# Altium schematic sheet IsolationBarriers.SchDoc
size A4; SheetNumber: 8; SheetTotal: 9
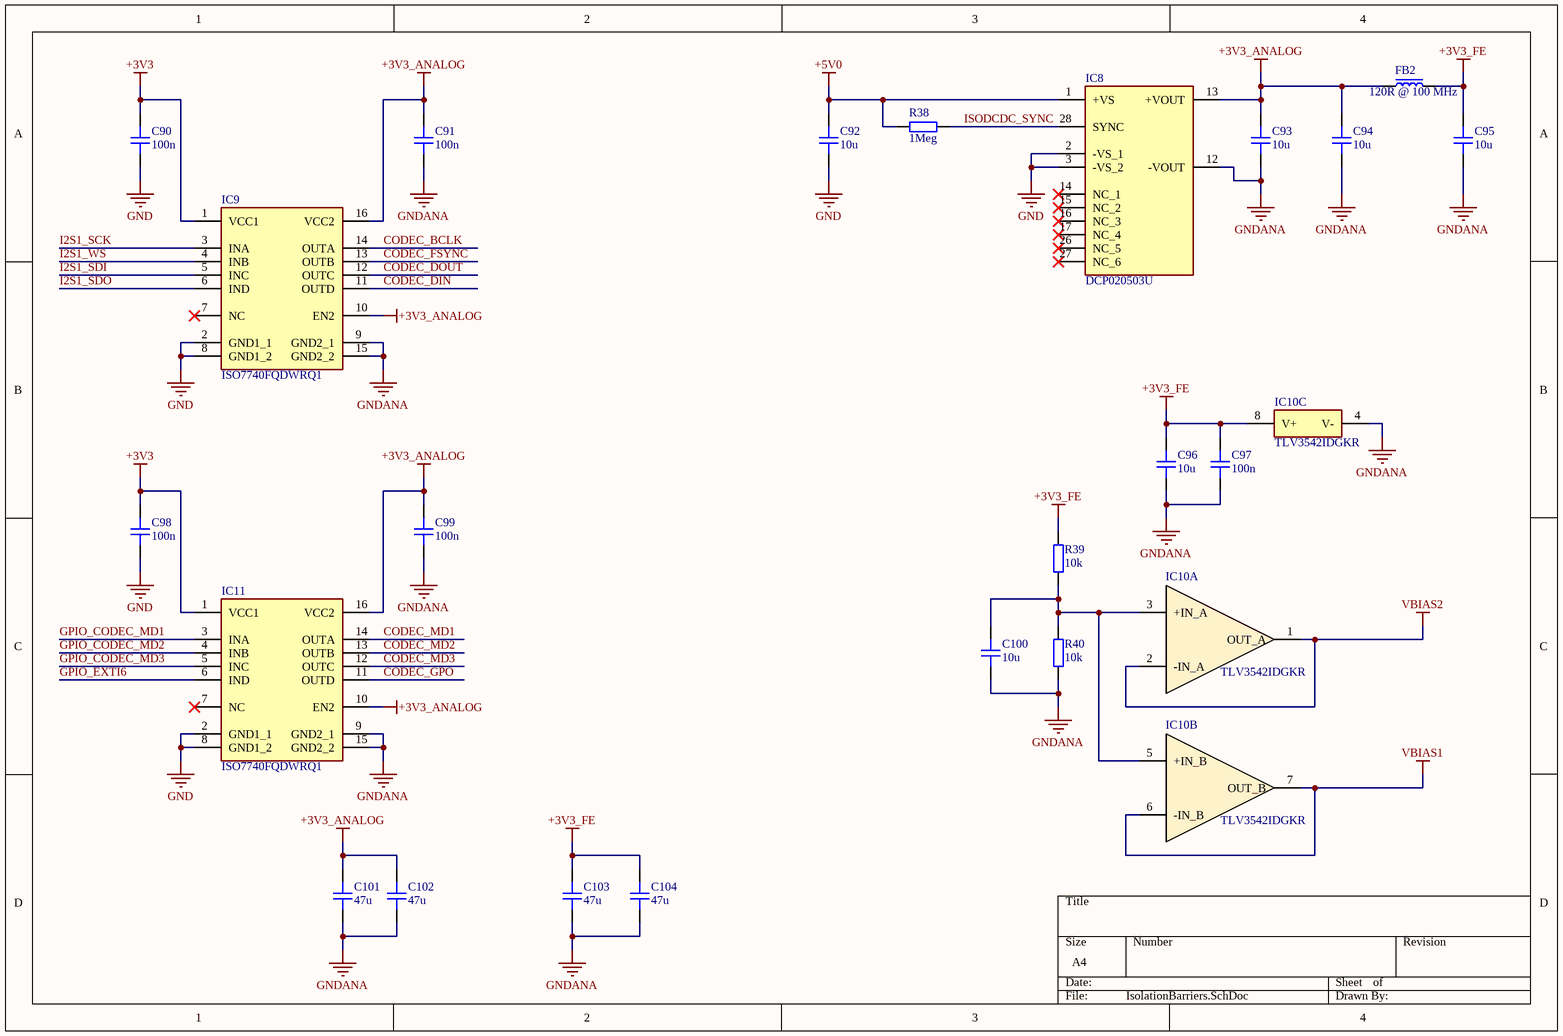
[diagram p0: IsolationBarriers.SchDoc]

## Parts
C90  100n  [CAP_0402]
C91  100n  [CAP_0402]
C92  10u  [CAP_0603]
C93  10u  [CAP_0603]
C94  10u  [CAP_0603]
C95  10u  [CAP_0603]
C96  10u  [CAP_0603]
C97  100n  [CAP_0402]
C98  100n  [CAP_0402]
C99  100n  [CAP_0402]
C100  10u  [CAP_0603]
C101  47u  [CAP_1210]
C102  47u  [CAP_1210]
C103  47u  [CAP_1210]
C104  47u  [CAP_1210]
FB2  120R @ 100 MHz  [FB_0603]
IC8  DCP020503U  [DVB0012A]
IC9  ISO7740FQDWRQ1  [SOIC127P1030X265-16N]
IC10  TLV3542IDGKR  [SOP65P490X110-8N]  (parts A,B,C of 3)
IC11  ISO7740FQDWRQ1  [SOIC127P1030X265-16N]
R38  1Meg  [RES_0402]
R39  10k  [RES_0603]
R40  10k  [RES_0603]

## Nets
+3V3: C90.2 C98.2 IC9.1(VCC1) IC11.1(VCC1)
+3V3_ANALOG: C91.2 C93.2 C94.2 C99.2 C101.2 C102.2 FB2.1 IC8.13(+VOUT) IC9.10(EN2) IC9.16(VCC2) IC11.10(EN2) IC11.16(VCC2)
+3V3_FE: C95.2 C96.2 C97.2 C103.2 C104.2 FB2.2 IC10.8(V+) R39.2
+5V0: C92.2 IC8.1(+VS) R38.1
GND: C90.1 C92.1 C98.1 IC8.2(-VS_1) IC8.3(-VS_2) IC9.2(GND1_1) IC9.8(GND1_2) IC11.2(GND1_1) IC11.8(GND1_2)
GNDANA: C91.1 C93.1 C94.1 C95.1 C96.1 C97.1 C99.1 C100.1 C101.1 C102.1 C103.1 C104.1 IC8.12(-VOUT) IC9.9(GND2_1) IC9.15(GND2_2) IC10.4(V-) IC11.9(GND2_1) IC11.15(GND2_2) R40.1
VBIAS1: IC10.6(-IN_B) IC10.7(OUT_B)
VBIAS2: IC10.1(OUT_A) IC10.2(-IN_A)
CODEC_BCLK: IC9.14(OUTA)
CODEC_DIN: IC9.11(OUTD)
CODEC_DOUT: IC9.12(OUTC)
CODEC_FSYNC: IC9.13(OUTB)
CODEC_GPO: IC11.11(OUTD)
CODEC_MD1: IC11.14(OUTA)
CODEC_MD2: IC11.13(OUTB)
CODEC_MD3: IC11.12(OUTC)
GPIO_CODEC_MD1: IC11.3(INA)
GPIO_CODEC_MD2: IC11.4(INB)
GPIO_CODEC_MD3: IC11.5(INC)
GPIO_EXTI6: IC11.6(IND)
I2S1_SCK: IC9.3(INA)
I2S1_SDI: IC9.5(INC)
I2S1_SDO: IC9.6(IND)
I2S1_WS: IC9.4(INB)
ISODCDC_SYNC: IC8.28(SYNC) R38.2
NetC100_2: C100.2 IC10.3(+IN_A) IC10.5(+IN_B) R39.1 R40.2

Not connected (* = marked no-connect by the designer): IC8 14(NC_1)* 15(NC_2)* 16(NC_3)* 17(NC_4)* 26(NC_5)* 27(NC_6)*; IC9 7(NC)*; IC11 7(NC)*

## Library data of the parts
C90 C91 C97-C99 = CAP_0402: Capacitor SMD 0402; Manufacturer: *; Manufacturer Part Number: *; Distributor Link: *; LCSC: *; Rating: *; Dielectric: *
C92-C96 C100 = CAP_0603: Capacitor SMD 0603; Manufacturer: *; Manufacturer Part Number: *; Distributor Link: *; LCSC: *; Rating: *; Dielectric: *
C101-C104 = CAP_1210: Capacitor SMD 1210; Manufacturer: *; Manufacturer Part Number: *; Distributor Link: *; LCSC: *; Rating: *; Dielectric: *
FB2 = FB_0603: Ferrite Bead SMD 0603; Manufacturer: *; Manufacturer Part Number: *; Distributor Link: *; LCSC: *
IC8 = DCP020503U: TI Isolated DC DC Converter; Manufacturer_Name: Texas Instruments; Datasheet Link: http://www.ti.com/lit/gpn/dcp020503; Manufacturer_Part_Number: DCP020503U; Mouser Part Number: 595-DCP020503U; Mouser Price/Stock: https://www.mouser.com/Search/Refine.aspx?Keyword=595-DCP020503U; Arrow Part Number: DCP020503U; Arrow Price/Stock: https://www.arrow.com/en/products/dcp020503u/texas-instruments
IC9 IC11 = ISO7740FQDWRQ1: Integrated Circuit; Manufacturer_Name: Texas Instruments; Datasheet Link: https://www.ti.com/lit/gpn/iso7740-q1; Height: 2.65mm; Manufacturer_Part_Number: ISO7740FQDWRQ1; Mouser Part Number: 595-ISO7740FQDWRQ1; Mouser Price/Stock: https://www.mouser.co.uk/ProductDetail/Texas-Instruments/ISO7740FQDWRQ1?qs=34RfhUjJmKfM2MieHZI64w%3D%3D; Arrow Part Number: ISO7740FQDWRQ1; Arrow Price/Stock: https://www.arrow.com/en/products/iso7740fqdwrq1/texas-instruments?utm_currency=USD&region=nac
IC10 = TLV3542IDGKR: Integrated Circuit; Manufacturer_Name: Texas Instruments; Datasheet Link: http://www.ti.com/lit/gpn/tlv3542; Height: 1.1mm; Manufacturer_Part_Number: TLV3542IDGKR; Mouser Part Number: 595-TLV3542IDGKR; Mouser Price/Stock: https://www.mouser.co.uk/ProductDetail/Texas-Instruments/TLV3542IDGKR?qs=9lcNTSmDlCr5gl2sVJgJdw%3D%3D; Arrow Part Number: TLV3542IDGKR; Arrow Price/Stock: https://www.arrow.com/en/products/tlv3542idgkr/texas-instruments
R38 = RES_0402: Resistor SMD 0402; Manufacturer: *; Manufacturer Part Number: *; Distributor Link: *; LCSC: *
R39 R40 = RES_0603: Resistor SMD 0603; Manufacturer: *; Manufacturer Part Number: *; Distributor Link: *; LCSC: *